# Altium schematic sheet WCAM-BREAKOUT-PCB-R01.SchDoc: WCAM-BREAKOUT-PCB-R01
size 594 x 420 mm; Author: T. Ludemann; Revision: 0.1; SheetNumber: 1; SheetTotal: 1; DocSize: DINA2
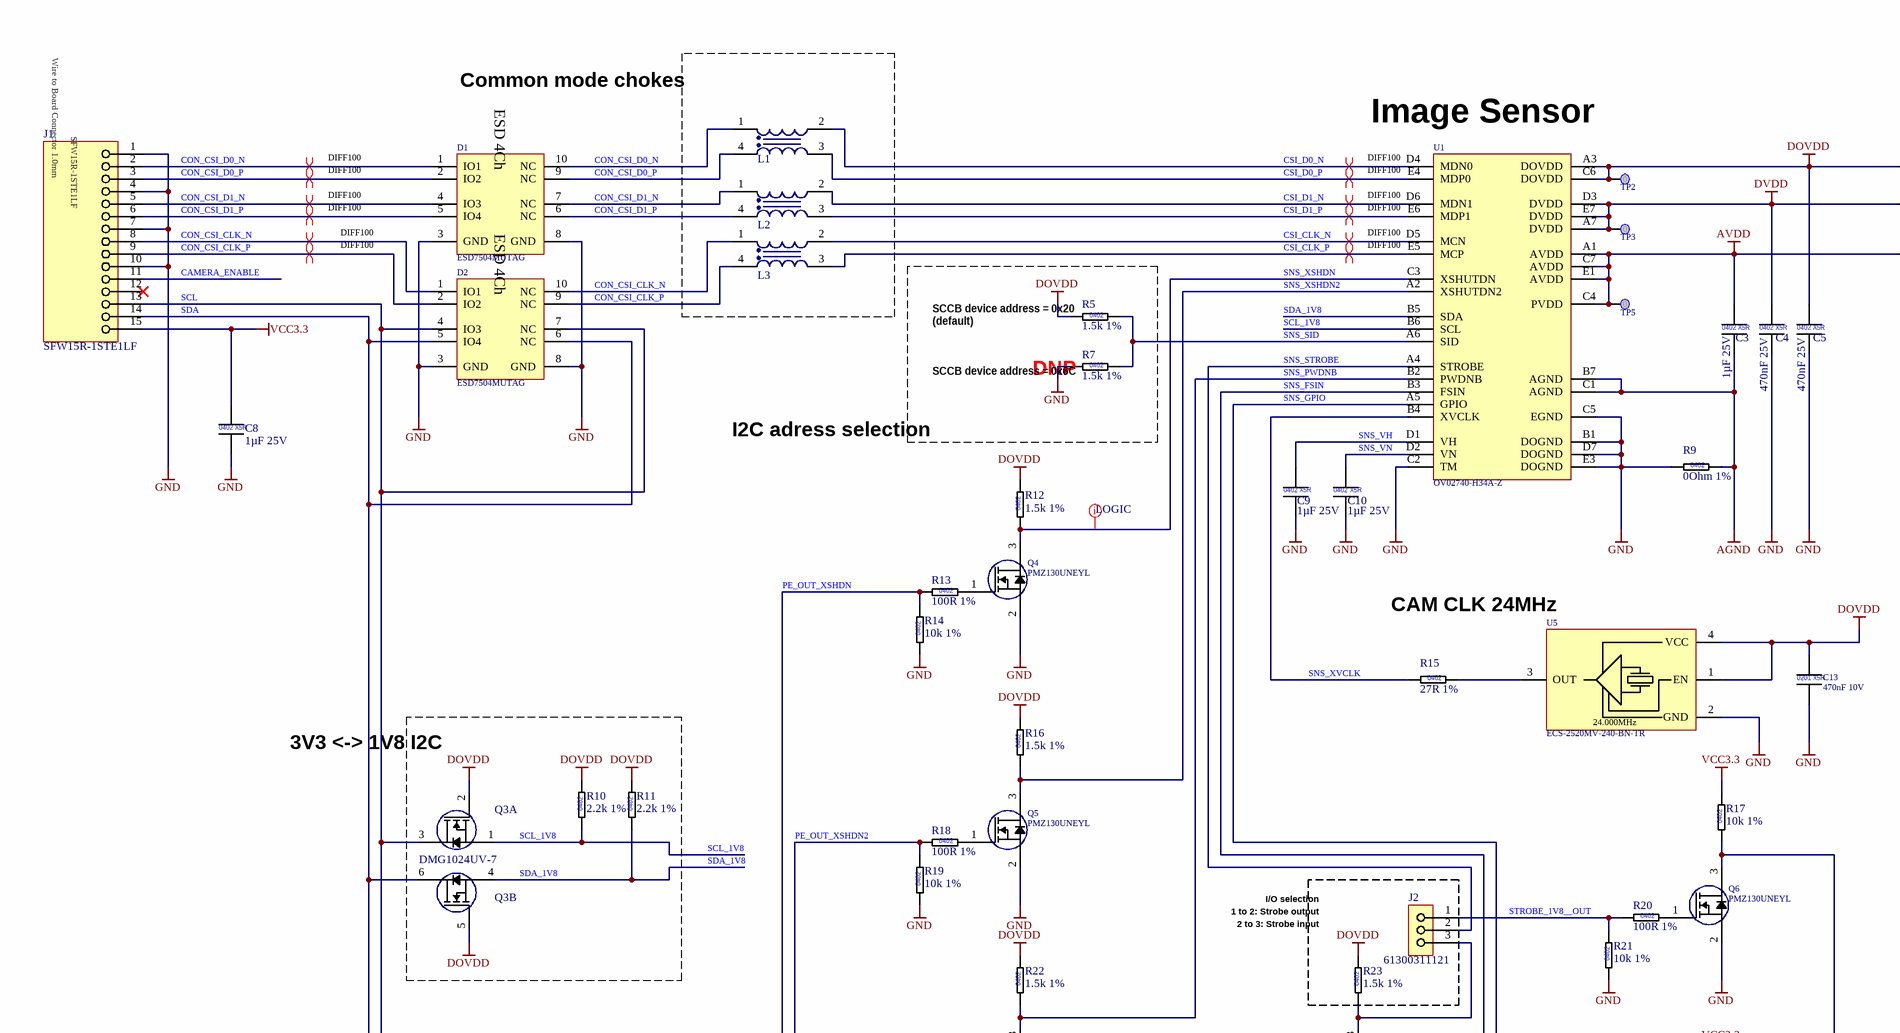
[diagram p0: WCAM-BREAKOUT-PCB-R01.SchDoc, top left]
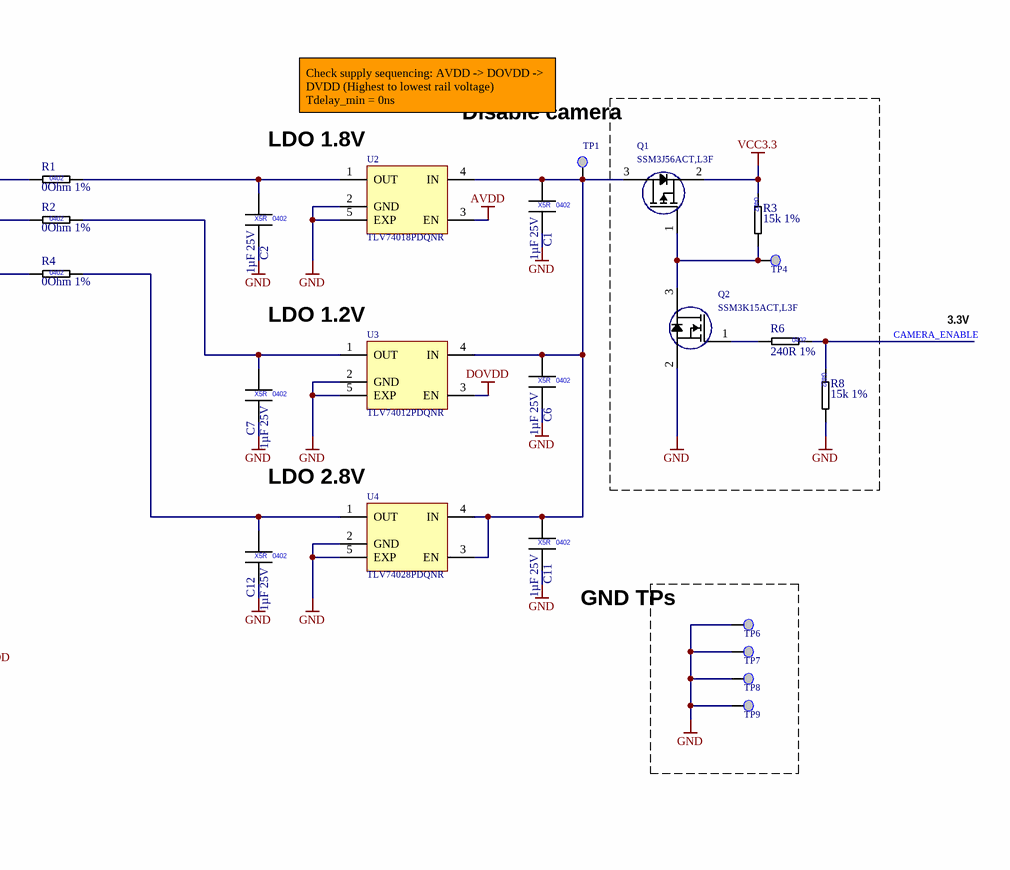
[diagram p1: WCAM-BREAKOUT-PCB-R01.SchDoc, top right]
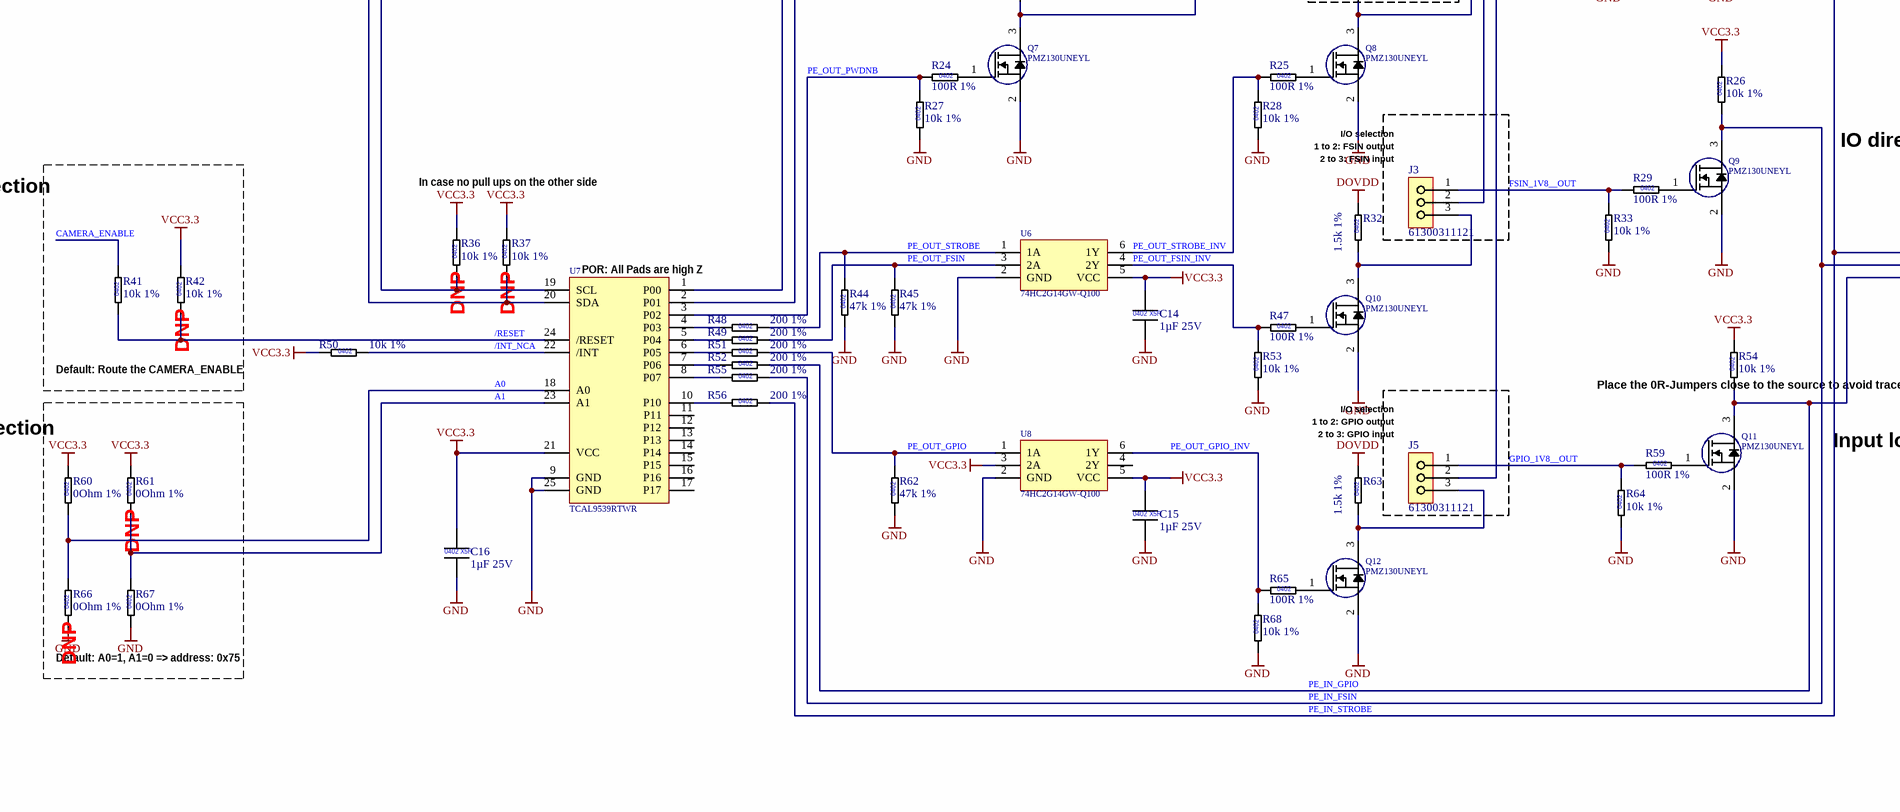
[diagram p2: WCAM-BREAKOUT-PCB-R01.SchDoc, bottom left]
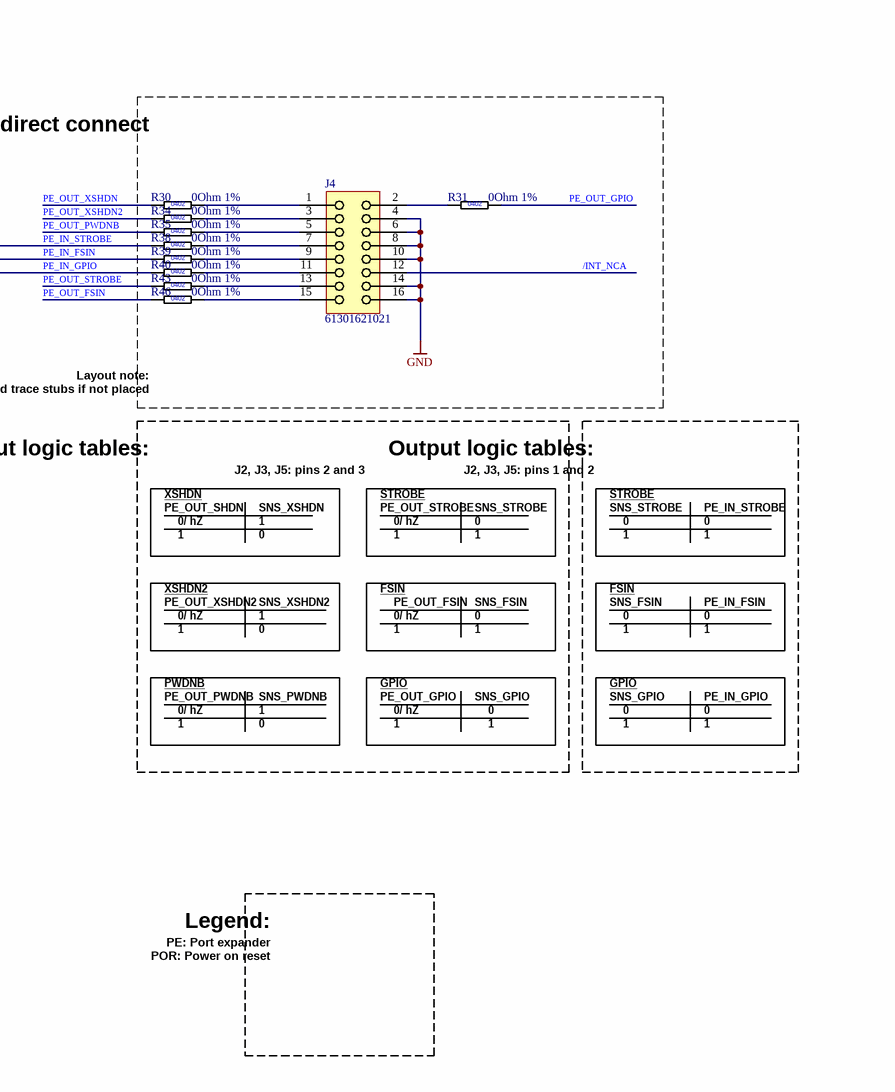
[diagram p3: WCAM-BREAKOUT-PCB-R01.SchDoc, bottom right]

## Parts
?  (no value)  (graphical)
C1  1µF 25V  [CAPC1005X06L]
C2  1µF 25V  [CAPC1005X06L]
C3  1µF 25V  [CAPC1005X06L]
C4  470nF 25V  [CAPC1005X06L]
C5  470nF 25V  [CAPC1005X06L]
C6  1µF 25V  [CAPC1005X06L]
C7  1µF 25V  [CAPC1005X06L]
C8  1µF 25V  [CAPC1005X06L]
C9  1µF 25V  [CAPC1005X06L]
C10  1µF 25V  [CAPC1005X06L]
C11  1µF 25V  [CAPC1005X06L]
C12  1µF 25V  [CAPC1005X06L]
C13  470nF 10V  [CAPC0603X03L]
C14  1µF 25V  [CAPC1005X06L]
C15  1µF 25V  [CAPC1005X06L]
C16  1µF 25V  [CAPC1005X06L]
D1  ESD7504MUTAG  [QFN50P250X100X55-10L]
D2  ESD7504MUTAG  [QFN50P250X100X55-10L]
J1  SFW15R-1STE1LF  [WIRE-TO-BOARD 15POL SFW15R-1STE1LF]
J2  61300311121  [BOARD TO BOARD Pinheader WE_61300311121]
J3  61300311121  [BOARD TO BOARD Pinheader WE_61300311121]
J4  61301621021  [BOARD TO BOARD Pinheader WE_61301621021]
J5  61300311121  [BOARD TO BOARD Pinheader WE_61300311121]
L1  90Ohm 100mA  [CAF-50P85X64-4N]  (value not drawn)
L2  90Ohm 100mA  [CAF-50P85X64-4N]  (value not drawn)
L3  90Ohm 100mA  [CAF-50P85X64-4N]  (value not drawn)
Q1  SSM3J56ACT,L3F  [DFN65P100X50-3L]
Q2  SSM3K15ACT,L3F  [DFN65P100X50-3L]
Q3  DMG1024UV-7  [SOTFL50P162X60-6N]  (value not drawn)  (parts A,B of 2)
Q4  PMZ130UNEYL  [DFN65P98X50-3N]
Q5  PMZ130UNEYL  [DFN65P98X50-3N]
Q6  PMZ130UNEYL  [DFN65P98X50-3N]
Q7  PMZ130UNEYL  [DFN65P98X50-3N]
Q8  PMZ130UNEYL  [DFN65P98X50-3N]
Q9  PMZ130UNEYL  [DFN65P98X50-3N]
Q10  PMZ130UNEYL  [DFN65P98X50-3N]
Q11  PMZ130UNEYL  [DFN65P98X50-3N]
Q12  PMZ130UNEYL  [DFN65P98X50-3N]
R1  0Ohm 1%  [RESC1005X04L]
R2  0Ohm 1%  [RESC1005X04L]
R3  15k 1%  [RESC1005X04L]
R4  0Ohm 1%  [RESC1005X04L]
R5  1.5k 1%  [RESC1005X04L]
R6  240R 1%  [RESC1005X04L]
R7  1.5k 1%  [RESC1005X04L]
R8  15k 1%  [RESC1005X04L]
R9  0Ohm 1%  [RESC1005X04L]
R10  2.2k 1%  [RESC1005X04L]
R11  2.2k 1%  [RESC1005X04L]
R12  1.5k 1%  [RESC1005X04L]
R13  100R 1%  [RESC1005X04L]
R14  10k 1%  [RESC1005X04L]
R15  27R 1%  [RESC1005X04L]
R16  1.5k 1%  [RESC1005X04L]
R17  10k 1%  [RESC1005X04L]
R18  100R 1%  [RESC1005X04L]
R19  10k 1%  [RESC1005X04L]
R20  100R 1%  [RESC1005X04L]
R21  10k 1%  [RESC1005X04L]
R22  1.5k 1%  [RESC1005X04L]
R23  1.5k 1%  [RESC1005X04L]
R24  100R 1%  [RESC1005X04L]
R25  100R 1%  [RESC1005X04L]
R26  10k 1%  [RESC1005X04L]
R27  10k 1%  [RESC1005X04L]
R28  10k 1%  [RESC1005X04L]
R29  100R 1%  [RESC1005X04L]
R30  0Ohm 1%  [RESC1005X04L]
R31  0Ohm 1%  [RESC1005X04L]
R32  1.5k 1%  [RESC1005X04L]
R33  10k 1%  [RESC1005X04L]
R34  0Ohm 1%  [RESC1005X04L]
R35  0Ohm 1%  [RESC1005X04L]
R36  10k 1%  [RESC1005X04L]
R37  10k 1%  [RESC1005X04L]
R38  0Ohm 1%  [RESC1005X04L]
R39  0Ohm 1%  [RESC1005X04L]
R40  0Ohm 1%  [RESC1005X04L]
R41  10k 1%  [RESC1005X04L]
R42  10k 1%  [RESC1005X04L]
R43  0Ohm 1%  [RESC1005X04L]
R44  47k 1%  [RESC1005X04L]
R45  47k 1%  [RESC1005X04L]
R46  0Ohm 1%  [RESC1005X04L]
R47  100R 1%  [RESC1005X04L]
R48  200 1%  [RESC1005X04L]
R49  200 1%  [RESC1005X04L]
R50  10k 1%  [RESC1005X04L]
R51  200 1%  [RESC1005X04L]
R52  200 1%  [RESC1005X04L]
R53  10k 1%  [RESC1005X04L]
R54  10k 1%  [RESC1005X04L]
R55  200 1%  [RESC1005X04L]
R56  200 1%  [RESC1005X04L]
R59  100R 1%  [RESC1005X04L]
R60  0Ohm 1%  [RESC1005X04L]
R61  0Ohm 1%  [RESC1005X04L]
R62  47k 1%  [RESC1005X04L]
R63  1.5k 1%  [RESC1005X04L]
R64  10k 1%  [RESC1005X04L]
R65  100R 1%  [RESC1005X04L]
R66  0Ohm 1%  [RESC1005X04L]
R67  0Ohm 1%  [RESC1005X04L]
R68  10k 1%  [RESC1005X04L]
TP1  Testpoint 0.5mm  [TP_0.50mm]  (value not drawn)  (no BOM)
TP2  Testpoint 0.5mm  [TP_0.50mm]  (value not drawn)  (no BOM)
TP3  Testpoint 0.5mm  [TP_0.50mm]  (value not drawn)  (no BOM)
TP4  Testpoint 0.5mm  [TP_0.50mm]  (value not drawn)  (no BOM)
TP5  Testpoint 0.5mm  [TP_0.50mm]  (value not drawn)  (no BOM)
TP6  Testpoint 0.5mm  [TP_0.50mm]  (value not drawn)  (no BOM)
TP7  Testpoint 0.5mm  [TP_0.50mm]  (value not drawn)  (no BOM)
TP8  Testpoint 0.5mm  [TP_0.50mm]  (value not drawn)  (no BOM)
TP9  Testpoint 0.5mm  [TP_0.50mm]  (value not drawn)  (no BOM)
U1  OV02740-H34A-Z  [BGA34C53P7X5_386X292X388]
U2  TLV74018PDQNR  [X2SON-DFN]
U3  TLV74012PDQNR  [X2SON-DFN]
U4  TLV74028PDQNR  [X2SON-DFN]
U5  ECS-2520MV-240-BN-TR  [Oscillator_ECS-2520MV]
U6  74HC2G14GW-Q100  [TSOP65P210X110-6N]
U7  TCAL9539RTWR  [QFN50P400X400X80_HS-25M]
U8  74HC2G14GW-Q100  [TSOP65P210X110-6N]

## Blocks framed on the sheet
Common mode chokes: L1-L3
Disable camera: Q1 Q2 R3 R6 R8 TP4
GND TPs: TP6-TP9
3V3 <-> 1V8 I2C: Q3 R10 R11
IO direct connect: J4 R30 R31 R34 R35 R38-R40 R43 R46

## Nets
AGND: C3.2 R9.2 U1.B7(AGND) U1.C1(AGND)
AVDD: C3.1 R4.1 TP5.TP U1.A1(AVDD) U1.C4(PVDD) U1.C7(AVDD) U1.E1(AVDD) U2.3(EN)
DOVDD: C5.1 C13.1 Q3.2(G) Q3.5(G) R1.1 R5.1 R10.2 R11.2 R12.2 R16.2 R22.2 R23.2 R32.2 R63.2 TP2.TP U1.A3(DOVDD) U1.C6(DOVDD) U3.3(EN) U5.1(EN) U5.4(VCC)
DVDD: C4.1 R2.1 TP3.TP U1.A7(DVDD) U1.D3(DVDD) U1.E7(DVDD)
GND: C1.2 C2.2 C4.2 C5.2 C6.2 C7.2 C8.2 C9.2 C10.2 C11.2 C12.2 C13.2 C14.2 C15.2 C16.2 D1.3(GND) D1.8(GND) D2.3(GND) D2.8(GND) J1.1 J1.4 J1.7 J1.10 J4.4 J4.6 J4.8 J4.10 J4.14 J4.16 Q2.2(S) Q4.2(S) Q5.2(S) Q6.2(S) Q7.2(S) Q8.2(S) Q9.2(S) Q10.2(S) Q11.2(S) Q12.2(S) R7.1 R8.2 R9.1 R14.1 R19.1 R21.1 R27.1 R28.1 R33.1 R44.1 R45.1 R53.1 R62.1 R64.1 R66.1 R67.1 R68.1 TP6.TP TP7.TP TP8.TP TP9.TP U1.B1(DOGND) U1.C2(TM) U1.C5(EGND) U1.D7(DOGND) U1.E3(DOGND) U2.2(GND) U2.5(EXP) U3.2(GND) U3.5(EXP) U4.2(GND) U4.5(EXP) U5.2(GND) U6.2(GND) U7.9(GND) U7.25(GND) U8.2(GND)
VCC3.3: C8.1 C14.1 C15.1 C16.1 J1.15 Q1.2(S) R3.1 R17.2 R26.2 R36.2 R37.2 R42.2 R50.1 R54.2 R60.2 R61.2 U6.5(VCC) U7.21(VCC) U8.3(2A) U8.5(VCC)
/INT_NCA: J4.12 R50.2 U7.22(/INT)
/RESET: R41.1 R42.1 U7.24(/RESET)
A0: R60.1 R66.2 U7.18(A0)
A1: R61.1 R67.2 U7.23(A1)
CAMERA_ENABLE: J1.11 R6.1 R8.1 R41.2
CON_CSI_CLK_N: D2.1(IO1) D2.10(NC) J1.8 L3.1
CON_CSI_CLK_P: D2.2(IO2) D2.9(NC) J1.9 L3.4
CON_CSI_D0_N: D1.1(IO1) D1.10(NC) J1.2 L1.1
CON_CSI_D0_P: D1.2(IO2) D1.9(NC) J1.3 L1.4
CON_CSI_D1_N: D1.4(IO3) D1.7(NC) J1.5 L2.1
CON_CSI_D1_P: D1.5(IO4) D1.6(NC) J1.6 L2.4
CSI_CLK_N: L3.2 U1.D5(MCN)
CSI_CLK_P: L3.3 U1.E5(MCP)
CSI_D0_N: L1.2 U1.D4(MDN0)
CSI_D0_P: L1.3 U1.E4(MDP0)
CSI_D1_N: L2.2 U1.D6(MDN1)
CSI_D1_P: L2.3 U1.E6(MDP1)
FSIN_1V8__OUT: J3.1 R29.1 R33.2
GPIO_1V8__OUT: J5.1 R59.1 R64.2
PE_IN_FSIN: Q9.3(D) R26.1 R39.1 R55.2
PE_IN_GPIO: Q11.3(D) R40.1 R52.2 R54.1
PE_IN_STROBE: Q6.3(D) R17.1 R38.1 R56.2
PE_OUT_FSIN: R45.2 R46.1 R49.2 U6.3(2A)
PE_OUT_FSIN_INV: R47.1 R53.2 U6.4(2Y)
PE_OUT_GPIO: R31.2 R51.2 R62.2 U8.1(1A)
PE_OUT_GPIO_INV: R65.1 R68.2 U8.6(1Y)
PE_OUT_PWDNB: R24.1 R27.2 R35.1 U7.3(P02)
PE_OUT_STROBE: R43.1 R44.2 R48.2 U6.1(1A)
PE_OUT_STROBE_INV: R25.1 R28.2 U6.6(1Y)
PE_OUT_XSHDN: R13.1 R14.2 R30.1 U7.1(P00)
PE_OUT_XSHDN2: R18.1 R19.2 R34.1 U7.2(P01)
SCL: D2.4(IO3) D2.7(NC) J1.13 Q3.3(D) R36.1 U7.19(SCL)
SCL_1V8: Q3.1(S) R10.1 U1.B6(SCL)
SDA: D2.5(IO4) D2.6(NC) J1.14 Q3.6(D) R37.1 U7.20(SDA)
SDA_1V8: Q3.4(S) R11.1 U1.B5(SDA)
SNS_FSIN: J3.2 U1.B3(FSIN)
SNS_GPIO: J5.2 U1.A5(GPIO)
SNS_PWDNB: Q7.3(D) R22.1 U1.B2(PWDNB)
SNS_SID: R5.2 R7.2 U1.A6(SID)
SNS_STROBE: J2.2 U1.A4(STROBE)
SNS_VH: C9.1 U1.D1(VH)
SNS_VN: C10.1 U1.D2(VN)
SNS_XSHDN: Q4.3(D) R12.1 U1.C3(XSHUTDN)
SNS_XSHDN2: Q5.3(D) R16.1 U1.A2(XSHUTDN2)
SNS_XVCLK: R15.1 U1.B4(XVCLK)
STROBE_1V8__OUT: J2.1 R20.1 R21.2
NetC1_1: C1.1 C6.1 C11.1 Q1.3(D) TP1.TP U2.4(IN) U3.4(IN) U4.3(EN) U4.4(IN)
NetC2_1: C2.1 R1.2 U2.1(OUT)
NetC7_1: C7.1 R2.2 U3.1(OUT)
NetC12_1: C12.1 R4.2 U4.1(OUT)
NetJ2_3: J2.3 Q8.3(D) R23.1
NetJ3_3: J3.3 Q10.3(D) R32.1
NetJ4_1: J4.1 R30.2
NetJ4_2: J4.2 R31.1
NetJ4_3: J4.3 R34.2
NetJ4_5: J4.5 R35.2
NetJ4_7: J4.7 R38.2
NetJ4_9: J4.9 R39.2
NetJ4_11: J4.11 R40.2
NetJ4_13: J4.13 R43.2
NetJ4_15: J4.15 R46.2
NetJ5_3: J5.3 Q12.3(D) R63.1
NetQ1_1: Q1.1(G) Q2.3(D) R3.2 TP4.TP
NetQ2_1: Q2.1(G) R6.2
NetQ4_1: Q4.1(G) R13.2
NetQ5_1: Q5.1(G) R18.2
NetQ6_1: Q6.1(G) R20.2
NetQ7_1: Q7.1(G) R24.2
NetQ8_1: Q8.1(G) R25.2
NetQ9_1: Q9.1(G) R29.2
NetQ10_1: Q10.1(G) R47.2
NetQ11_1: Q11.1(G) R59.2
NetQ12_1: Q12.1(G) R65.2
NetR15_2: R15.2 U5.3(OUT)
NetR48_1: R48.1 U7.4(P03)
NetR49_1: R49.1 U7.5(P04)
NetR51_1: R51.1 U7.6(P05)
NetR52_1: R52.1 U7.7(P06)
NetR55_1: R55.1 U7.8(P07)
NetR56_1: R56.1 U7.10(P10)

Not connected (* = marked no-connect by the designer): J1 12*; U7 11(P11) 12(P12) 13(P13) 14(P14) 15(P15) 16(P16) 17(P17); U8 4(2Y)

## Layout directives
differential pair; differential pair class DIFF100: CON_CSI_CLK_N, CON_CSI_CLK_P, CON_CSI_D0_N, CON_CSI_D0_P, CON_CSI_D1_N, CON_CSI_D1_P, CSI_CLK_N, CSI_CLK_P, CSI_D0_N, CSI_D0_P, CSI_D1_N, CSI_D1_P
net class LOGIC: SNS_XSHDN

## Notes on the sheet
- Image Sensor
- Check supply sequencing: AVDD -> DOVDD -> DVDD (Highest to lowest rail voltage)
  Tdelay_min = 0ns
- (near U2) LDO 1.8V
- (near R5) SCCB device address = 0x20
- (near U3) LDO 1.2V
- 3.3V
- (near R7) SCCB device address = 0x6C
- (default)
- (near R7) DNP
- I2C adress selection
- (near U4) LDO 2.8V
- (near U5) CAM CLK 24MHz
- I/O selection
- (near J2) 1 to 2: Strobe output
- (near J2) 2 to 3: Strobe input
- Reset logic selection
- In case no pull ups on the other side
- (near J3) 1 to 2: FSIN output
- (near J3) 2 to 3: FSIN input
- (near R42) DNP
- (near R36) DNP
- (near R37) DNP
- (near U7) POR: All Pads are high Z
- Default: Route the CAMERA_ENABLE
- Place the 0R-Jumpers close to the source to avoid trace stubs if not placed
- Layout note:
- (near J5) 1 to 2: GPIO output
- (near J5) 2 to 3: GPIO input
- Input logic tables:
- Output logic tables:
- (near R61) DNP
- PE_OUT_SHDN
- XSHDN
- SNS_XSHDN
- J2, J3, J5: pins 2 and 3
- PE_OUT_STROBE
- STROBE
- SNS_STROBE
- J2, J3, J5: pins 1 and 2
- PE_IN_STROBE
- 0/ hZ
- 1
- 0
- (near R66) DNP
- PE_OUT_XSHDN2
- XSHDN2
- SNS_XSHDN2
- FSIN
- PE_OUT_FSIN
- SNS_FSIN
- PE_IN_FSIN
- Default: A0=1, A1=0 => address: 0x75
- PE_OUT_PWDNB
- PWDNB
- SNS_PWDNB
- PE_OUT_GPIO
- GPIO
- SNS_GPIO
- PE_IN_GPIO
- Legend:
- PE: Port expander
- POR: Power on reset
- © OV Tech GmbH - Open Visions Technology
- (in symbol CAP_0201_470nF_10V) 0201; X5R
- (in symbol CAP_0402_1µ_25V) 0402; X5R
- (in symbol CAP_0402_470n_25V) 0402; X5R
- (in symbol Crystal Oscillator_ECS-2520MV-240-BN-TR) 24.000MHz
- (in symbol ESD Protection Diode_ESD7504MUTAG) ESD 4Ch
- (in symbol RES_0402_0R_1%) 0402
- (in symbol RES_0402_1.5k_1%) 0402
- (in symbol RES_0402_2.2k_1%) 0402
- (in symbol RES_0402_10k_1%) 0402
- (in symbol RES_0402_15k_1%) 0402
- (in symbol RES_0402_27R_1%) 0402
- (in symbol RES_0402_47k_1%) 0402
- (in symbol RES_0402_100R_1%) 0402
- (in symbol RES_0402_200_1%) 0402
- (in symbol RES_0402_240R_1%) 0402
- (in symbol Wire to Board Connector_15pol_SFW15R-1STE1LF) Wire to Board Connector 1.0mm

## Library data of the parts
? = Titleblock_01
C1-C3 C6-C12 C14-C16 = CAP_0402_1µ_25V: Multilayer Ceramic Capacitors MLCC - SMD/SMT 0402 25VDC; Manufacturer 1: Murata Electronics; Manufacturer 1 Prt. Nr.: GRM155R61E105KE11D; Manufacturer 2 Prt. Nr.: 0402X105K250CT; Manufacturer 2: Walsin
C4 C5 = CAP_0402_470n_25V: Multilayer Ceramic Capacitors MLCC - SMD/SMT 0402 25VDC; Manufacturer 1: Murata Electronics; Manufacturer 1 Prt. Nr.: GRM155R61E474KE01D; Manufacturer 2 Prt. Nr.: 0603X474K250CT; Manufacturer 2: Walsin
C13 = CAP_0201_470nF_10V: Multilayer Ceramic Capacitors MLCC - SMD/SMT 0201 10VDC; Manufacturer 1: Taiyo Yuden; Manufacturer 1 Prt. Nr.: LMK063BBJ474KPLF; Manufacturer 2 Prt. Nr.: C0603X5R1A474M030BC; Manufacturer 2: TDK
D1 D2 = ESD Protection Diode_ESD7504MUTAG: ESD-Entstörer/TVS-Dioden LOW CAP ESD Protection; Manufacturer 1: onsemi; Manufacturer 1 Prt. Nr.: ESD7504MUTAG
J1 = Wire to Board Connector_15pol_SFW15R-1STE1LF: Wire to Board Connector 15pol 1.0mm Pitch; Manufacturer 1: Amphenol FCI; Manufacturer 1 Prt. Nr.: SFW15R-1STE1LF
J2 J3 J5 = Pin Header_3pol_61300311121: Pin Header 3 Pol 2.54mm; Manufacturer 1: Würth elektronik; Manufacturer 1 Prt. Nr.: 61300311121
J4 = Pin Header_16pol_61301621021: Pin Header 3 Pol 2.54mm; Manufacturer 1: Würth elektronik; Manufacturer 1 Prt. Nr.: 61301621021
L1-L3 = Common Mode Choke_LM0NSM900HY2#: Murata Common Mode Choke 90Ohm 100mA for ,USB2.0,USB3.1 Gen1,USB3.1 Gen2,MIPI D-PHY Ver1.1,MIPI D-PHY Ver1.2,HDMI 1.4b; Manufacturer 1: Murata Electronics; Manufacturer 1 Prt. Nr.: DLM0NSM900HY2D
Q1 = P-Channel MOSFET_SSM3J56ACT,L3F: MOSFET 20V SGL P-CH TRENCHMOS Logic Level; Manufacturer 1: Toshiba; Manufacturer 1 Prt. Nr.: SSM3J56ACT,L3F
Q2 = N-Channel MOSFET_SSM3K15ACT,L3F: MOSFET 30V SGL N-CH TRENCHMOS Logic Level; Manufacturer 1: Toshiba; Manufacturer 1 Prt. Nr.: SSM3K15ACT,L3F
Q3 = N-Channel DMG1024UV: Dual N-Channel MOSFET; Manufacturer 1: Diodes Incorporated; Manufacturer 1 Prt. Nr.: DMG1024UV-7
Q4-Q12 = N-Channel MOSFET_PMZ130UNEYL: MOSFET PMZ130UNE/SOT883/XQFN3; Manufacturer 1: Nexperia; Manufacturer 1 Prt. Nr.: PMZ130UNEYL
R1 R2 R4 R9 R30 R31 R34 R35 R38-R40 R43 R46 R60 R61 R66 R67 = RES_0402_0R_1%: Thick Film Resistors - SMD 0OHM 1%; Manufacturer 1: Bourns; Manufacturer 1 Prt. Nr.: CR0402AJ/-000GAS; Manufacturer 2 Prt. Nr.: AC0402FR-070RL; Manufacturer 2: YAGEO
R3 R8 = RES_0402_15k_1%: Thick Film Resistors - SMD 15k 1%; Manufacturer 1: Vishay / Dale; Manufacturer 1 Prt. Nr.: CRCW040215K0FKED; Manufacturer 2 Prt. Nr.: RT0402FRE0715KL; Manufacturer 2: YAGEO
R5 R7 R12 R16 R22 R23 R32 R63 = RES_0402_1.5k_1%: Thick Film Resistors - SMD 1.5k 1%; Manufacturer 1: Vishay / Dale; Manufacturer 1 Prt. Nr.: CRCW04021K50FKED; Manufacturer 2 Prt. Nr.: RC0402FR-131K5L; Manufacturer 2: YAGEO
R6 = RES_0402_240R_1%: Thick Film Resistors - SMD 240R 1%; Manufacturer 1: Vishay / Dale; Manufacturer 1 Prt. Nr.: CRCW0402240RFKEDC; Manufacturer 2 Prt. Nr.: RC0402FR-13240RL; Manufacturer 2: YAGEO
R10 R11 = RES_0402_2.2k_1%: Thick Film Resistors - SMD 2.2k 1%; Manufacturer 1: Vishay / Dale; Manufacturer 1 Prt. Nr.: CRCW04022K20FKED; Manufacturer 2 Prt. Nr.: ERJ-2RKF2201X; Manufacturer 2: Panasonic
R13 R18 R20 R24 R25 R29 R47 R59 R65 = RES_0402_100R_1%: Thick Film Resistors - SMD 100R 1%; Manufacturer 1: Vishay / Dale; Manufacturer 1 Prt. Nr.: CRCW0402100RFKEDC; Manufacturer 2 Prt. Nr.: RC0402FR-07100RL; Manufacturer 2: YAGEO
R14 R17 R19 R21 R26-R28 R33 R36 R37 R41 R42 R50 R53 R54 R64 R68 = RES_0402_10k_1%: Thick Film Resistors - SMD 10k 1%; Manufacturer 1: Vishay / Dale; Manufacturer 1 Prt. Nr.: CRCW040210K0FKEDC; Manufacturer 2 Prt. Nr.: RT0402FRE0710KL; Manufacturer 2: YAGEO
R15 = RES_0402_27R_1%: Thick Film Resistors - SMD 27R 1%; Manufacturer 1: YAGEO; Manufacturer 1 Prt. Nr.: RC0402FR-0727RL; Manufacturer 2 Prt. Nr.: CRGCQ0402F27R; Manufacturer 2: TE Connectivity Passive Product
R44 R45 R62 = RES_0402_47k_1%: Thick Film Resistors - SMD 47k 1%; Manufacturer 1: Vishay / Dale; Manufacturer 1 Prt. Nr.: CRCW040247K0FKEDC; Manufacturer 2 Prt. Nr.: RT0402FRE0747KL; Manufacturer 2: YAGEO
R48 R49 R51 R52 R55 R56 = RES_0402_200_1%: Thick Film Resistors - SMD 200 1%; Manufacturer 1: Panasonic; Manufacturer 1 Prt. Nr.: ERJ-2RKF2000X; Manufacturer 2 Prt. Nr.: CR0402-FX-2000GLF; Manufacturer 2: Bourns
U1 = Image Sensor_OV2740: MIPI CSI Image Sensor 1080p 1/6"; Manufacturer 1 Prt. Nr.: OmniVision; Manufacturer 1: OV02740-H34A-Z
U2 = LDO 1.8V_TLV74018PDQNR: LDO voltage regulator 300mA X2SON; Manufacturer 1: Texas Instruments; Manufacturer 1 Prt. Nr.: TLV74018PDQNR
U3 = LDO 1.2V_TLV74012PDQNR: LDO voltage regulator 300mA X2SON; Manufacturer 1: Texas Instruments; Manufacturer 1 Prt. Nr.: TLV74012PDQNR
U4 = LDO 2.8V_TLV74028PDQNR: LDO voltage regulator 300mA X2SON; Manufacturer 1: Texas Instruments; Manufacturer 1 Prt. Nr.: TLV74028PDQNR
U5 = Crystal Oscillator_ECS-2520MV-240-BN-TR: Crystal Oscillator 2520 miniature SMD package; Manufacturer 1: ECS; Manufacturer 1 Prt. Nr.: ECS-2520MV-240-BN-TR
U6 U8 = Dual inverting Schmitt trigger 74HC2G14GW-Q100: Schmitt Trigger Inverter, 1I/P, 125Deg C Rohs Compliant: Yes |Nexperia 74HC2G14GW-Q100; Manufacturer 1: Nexperia; Manufacturer 1 Prt. Nr.: 74HC2G14GW-Q100
U7 = SMBus I/O expander_TCAL9539RTWR: TCAL9539 Low-Voltage 16-Bit I2C-Bus, SMBus I/O Expander with Interrupt Output, / Reset, and Configuration Registers; Manufacturer 1: Texas Instruments; Manufacturer 1 Prt. Nr.: TCAL9539RTWR